# EAGLE design ESOL01 - Sol + Pump (EAGLE 7.4.0)
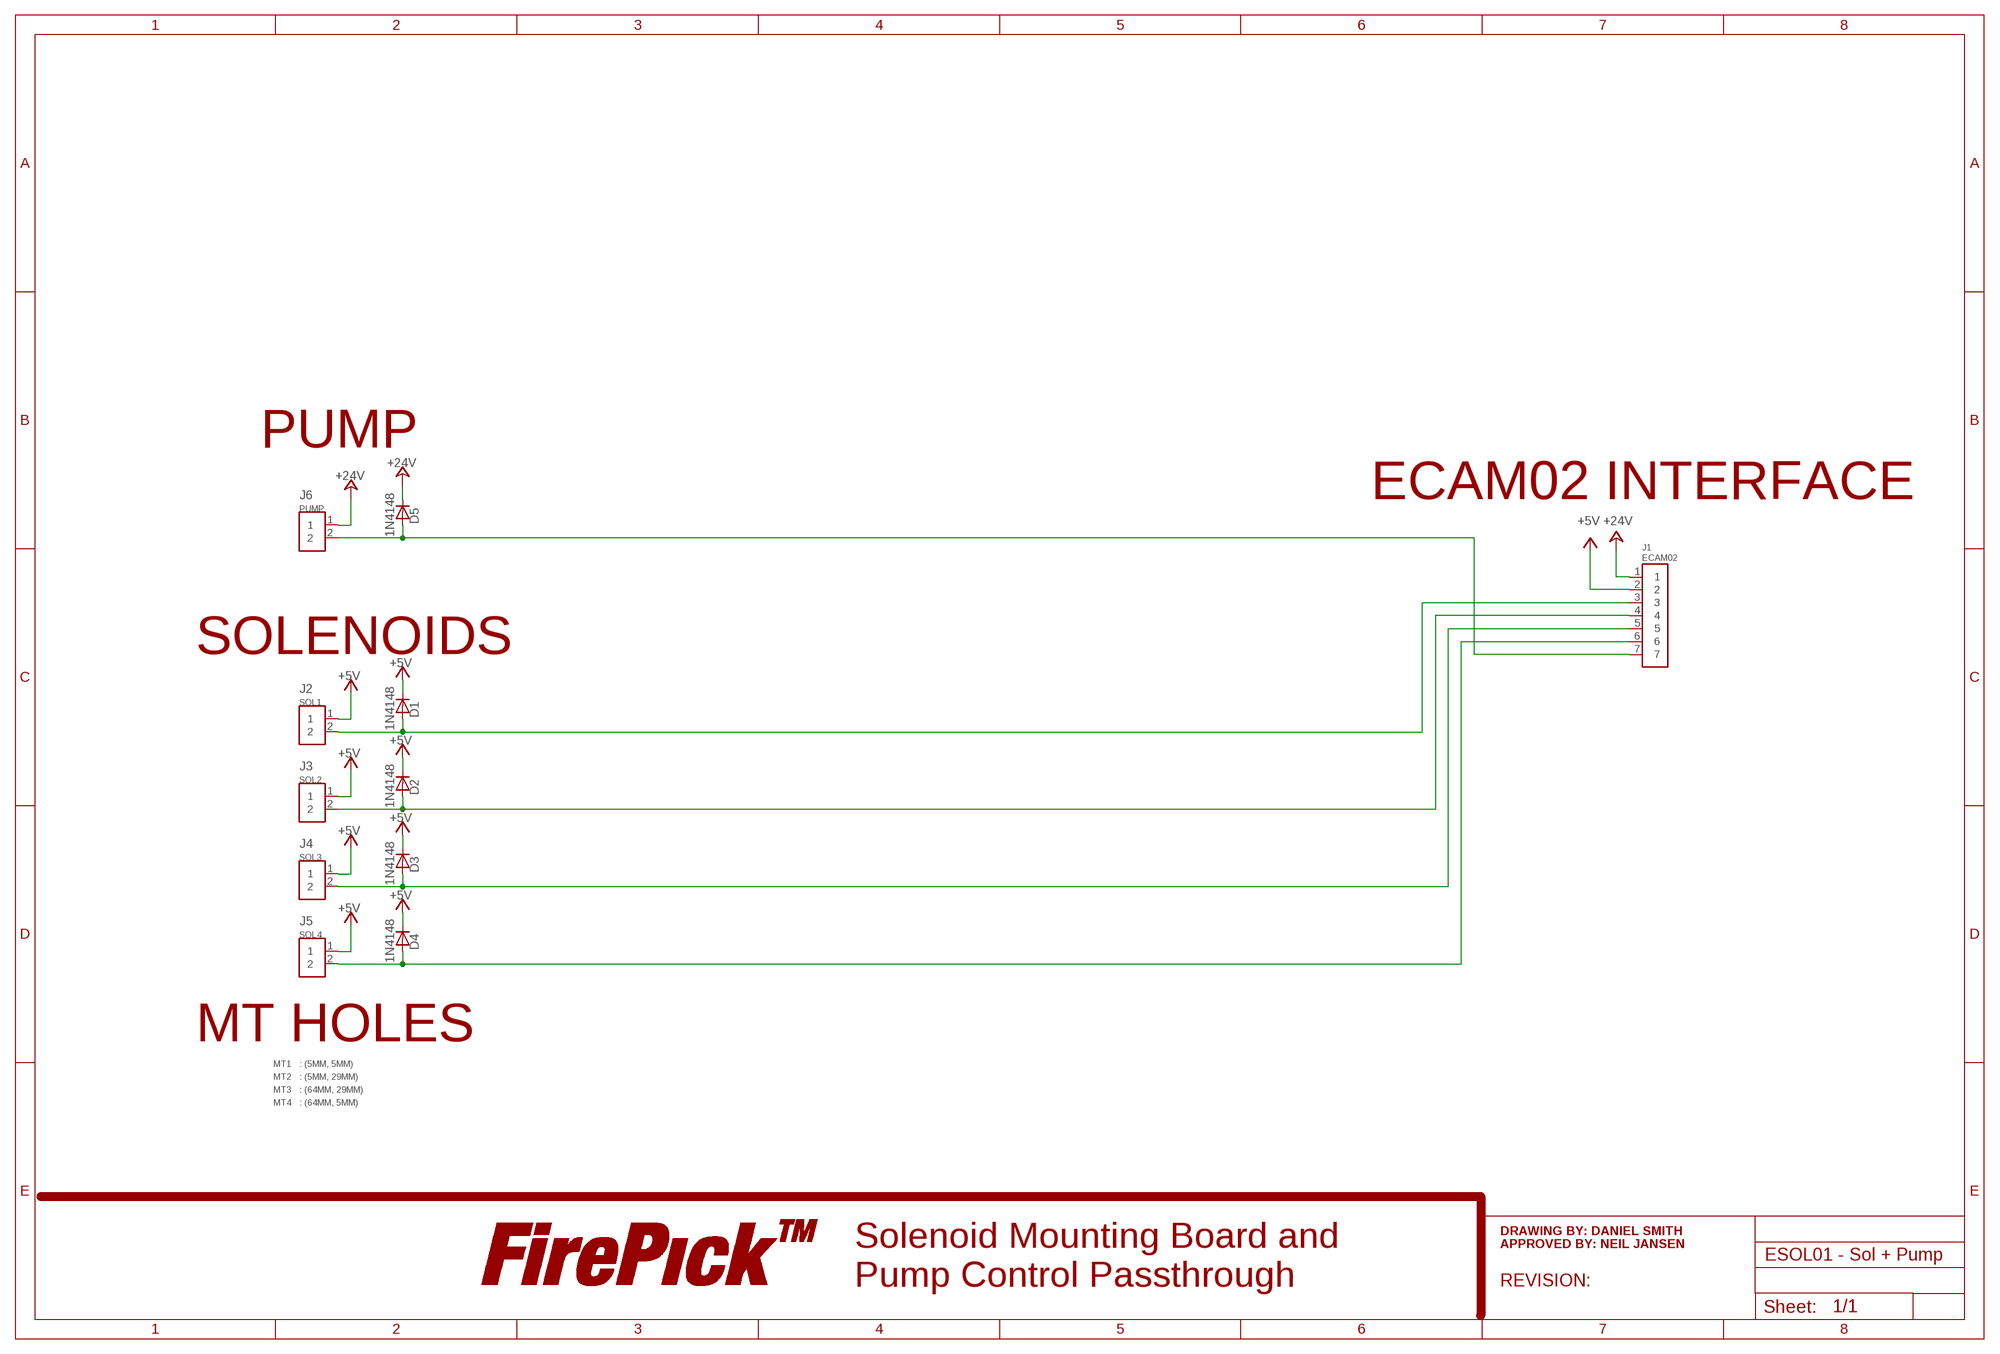
[diagram p0: schematic, sheet 1]

## Parts
D1  1N4148  CPL-DIO-1N4148SOD-323  [SOD-323]
D2  1N4148  CPL-DIO-1N4148SOD-323  [SOD-323]
D3  1N4148  CPL-DIO-1N4148SOD-323  [SOD-323]
D4  1N4148  CPL-DIO-1N4148SOD-323  [SOD-323]
D5  1N4148  CPL-DIO-1N4148SOD-323  [SOD-323]
J1  ECAM02  CPL-CON-JST-2.0MM-7P-M-SMT-VRT  [CON-JST-PH-2.0MM-7P-SMT-VRT]
J2  SOL1  HOLEX2  [HOLEX2]
J3  SOL2  HOLEX2  [HOLEX2]
J4  SOL3  HOLEX2  [HOLEX2]
J5  SOL4  HOLEX2  [HOLEX2]
J6  PUMP  CPL-CON-JST-2.0MM-2P-M-SMT-VRT  [CON-JST-PH-2.0MM-2P-SMT-VRT]
LOGO2  LOGO-FIREPICKLARGE  [LOGO-FIREPICK]
MT1  : (5MM, 5MM)  MTHOLE(M3)  [MTHOLE(M3)]
MT2  : (5MM, 29MM)  MTHOLE(M3)  [MTHOLE(M3)]
MT3  : (64MM, 29MM)  MTHOLE(M3)  [MTHOLE(M3)]
MT4  : (64MM, 5MM)  MTHOLE(M3)  [MTHOLE(M3)]

## Nets
+5V: D1.NEG(C) D2.NEG(C) D3.NEG(C) D4.NEG(C) J1.2 J2.1 J3.1 J4.1 J5.1
+24V: D5.NEG(C) J1.1 J6.1
N$7: D1.POS(A) J1.3 J2.2
N$8: D2.POS(A) J1.4 J3.2
N$9: D3.POS(A) J1.5 J4.2
N$10: D4.POS(A) J1.6 J5.2
N$11: D5.POS(A) J1.7 J6.2

## Notes on the sheet
- PUMP
- ECAM02 INTERFACE
- SOLENOIDS
- MT HOLES
- DRAWING BY: DANIEL SMITH
- APPROVED BY: NEIL JANSEN
- Solenoid Mounting Board and
  Pump Control Passthrough
- REVISION:

## Library data of the parts
D1-D5 = TinWhiskers:CPL-DIO-1N4148: Diode: 1N4148, General Purpose, 75V-100V, 100mA-500mA, 1-3Vr; Datasheet: http://www.vishay.com/docs/85886/1n4148wsfl-g.pdf
J1 = TinWhiskers:CPL-CON-JST-2.0MM-7P-M-SMT-VRT: Connector: 2.0MM Pitch, 7-Pin, (JST: B7B-PH-SM4-TB(LF)(SN)); Package: SMT, Vertical' Datasheet: http://www.jst-mfg.com/product/detail_e.php?series=199
J2-J5 = TinWhiskers:HOLEX2: 2-Pin Drill: 0.09" Dia., 0.1" Pitch
J6 = TinWhiskers:CPL-CON-JST-2.0MM-2P-M-SMT-VRT: Connector: 2.0MM Pitch, 2-Pin; Package: SMT, Vertical; Datasheet: http://www.jst-mfg.com/product/pdf/eng/ePH.pdf
LOGO2 = FirePick:LOGO-FIREPICK; BOM: EXCLUDE; DNP: T
MT1-MT4 = TinWhiskers:MTHOLE(M3): Mounting Hole: Diameter (3.5mm), Keepout (7mm)

## Board
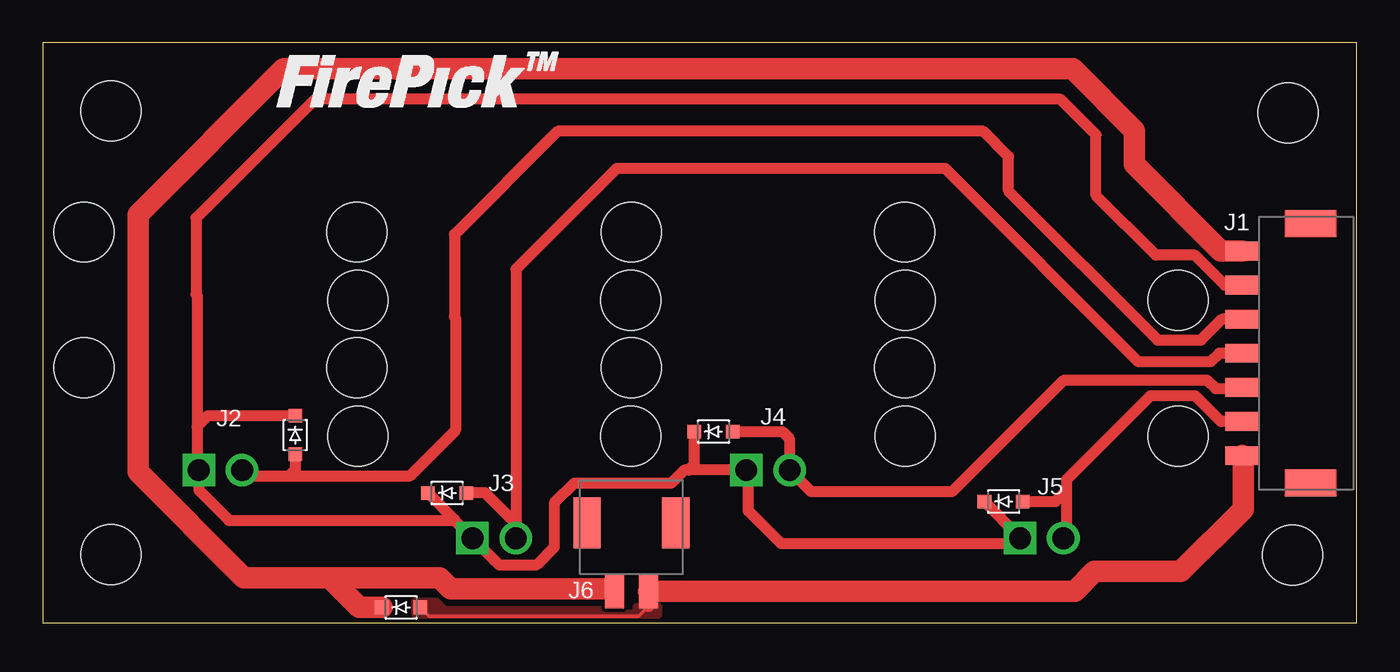
[diagram p1: board, top side]

Size 77 x 34 mm. Coordinates in mm from the lower left corner, seen from the top.
Outline: 0,0 77,0 77,34 0,34 0,0
Copper layers (1*2*15*16): Top 0.035mm / dielectric 0.2mm / Route2 0.0175mm / dielectric 0.3mm / Route15 0.0175mm / dielectric 0.2mm / Bottom 0.035mm
Design rules "HQPCB_4layer_DRU_no_angle": minimum track width 6mil, minimum drill 12mil, track to track 8mil, track to pad 8mil, pad to pad 6mil, via to via 8mil, smd to smd 0mil, copper to edge 10mil, drill to drill 8mil, minimum pad ring 6mil, minimum via ring 4mil, stop-mask expansion 2mil, vias tented up to drill 100mil, thermal gap 10mil

### Footprints (pad centres in the part's own frame; a part is rotated, then mirrored left to right if it is on the bottom)
SOD-323 = smd 0.8 x 0.8: NEG -1.125,0; POS 1.125,0
CON-JST-PH-2.0MM-7P-SMT-VRT = smd 1.1 x 2: 1 -6,0.1; 2 -4,0.1; 3 -2,0.1; 4 0,0.1; 5 2,0.1; 6 4,0.1; 7 6,0.1 | smd 1.6 x 3: NC1 -7.6,4.1; NC2 7.6,4.1
HOLEX2 = drill 1.27 square: 1 -1.27,0 | drill 1.27: 2 1.27,0 | hole 3.5: -8,6; -8,13.95; 8,13.95; 8,6
CON-JST-PH-2.0MM-2P-SMT-VRT = smd 1.1 x 2: 1 -1,0; 2 1,0 | smd 1.6 x 3: NC1 -2.6,4; NC2 2.6,4
MTHOLE(M3) = hole 3.5: 0,0

### Placement (x,y rotation side)
D1  14.8,11 270 top
D2  23.7,7.6 0 top
D3  39.3,11.2 0 top
D4  56.3,7.1 0 top
D5  21,0.9 0 top
J1  70.18,15.79 270 top
J2  10.42,8.95 0 top
J3  26.46,4.95 0 top
J4  42.5,8.95 0 top
J5  58.54,4.95 0 top
J6  34.5,1.85 0 top
LOGO2  13.51,28.47 0 top
MT1  4,4 0 top
MT2  4,30 0 top
MT3  72.97,29.89 0 top
MT4  73.23,3.96 0 top

### Tracks (layer width: path | path; a pad name or v marks a point on that pad's centre or on a via)
+5V
  Top 0.203: 9.04,9.05 J2.1 | 41.35,8.82 J4.1 | 25.15,4.91 J3.1
  Top 0.635: 9.04,11.49 9.04,19.2 8.99,19.25 8.99,23.72 15.95,30.68 59.64,30.68 61.72,28.6 61.72,25.04 65.23,21.54 67.51,21.54 69.26,19.79 J1.2 | 9.04,11.49 9.04,9.05 | 41.35,8.82 41.35,6.55 43.28,4.62 56.94,4.62 J5.1 57.27,5.01 D4.NEG | J4.1 37.85,8.95 | 37.85,8.95 37.6,8.95 36.83,8.18 31.14,8.18 29.97,7.01 29.97,4.42 28.96,3.4 26.72,3.4 26.47,3.65 26.47,3.66 J3.1 24.14,5.99 | J2.1 9.14,7.77 10.92,5.99 24.14,5.99 | 24.14,5.99 24.14,6.04 D2.NEG | D1.NEG 9.67,12.12 9.04,11.49 | D3.NEG 38.17,9.28 37.85,8.95
+24V
  Top 0.203: 33.35,2 J6.1
  Top 1.27: 33.35,2 23.9,2 23.26,2.64 16.8,2.64 | J1.1 69.04,21.79 63.96,26.87 63.96,28.85 60.35,32.46 14.12,32.46 5.59,23.93 5.59,8.84 11.79,2.64 16.8,2.64 | D5.NEG 18.54,0.9 16.8,2.64
N$7
  Top 0.635: J2.2 12.05,8.59 14.41,8.59 | 14.41,8.59 21.49,8.59 24.18,11.28 24.18,17.88 24.13,17.93 24.13,22.76 30.18,28.8 55.12,28.8 56.59,27.33 56.59,25.3 65.33,16.56 67.87,16.56 69.1,17.79 J1.3 | D1.POS 14.8,8.97 14.41,8.59
N$8
  Top 0.635: J1.4 68.93,15.79 68.43,15.29 64.21,15.29 52.88,26.62 33.63,26.62 27.74,20.73 27.74,5.79 | J3.2 27.74,5.79 | 27.74,5.79 25.91,7.62 24.84,7.62 D2.POS
N$9
  Top 0.635: J1.5 70.21,13.72 68.73,13.72 68.22,14.22 59.84,14.22 53.29,7.67 45.04,7.67 J4.2 43.75,8.96 43.75,10.79 43.35,11.2 D3.POS
N$10
  Top 0.635: J1.6 69.03,11.79 67.51,13.31 64.92,13.31 59.99,8.38 59.99,7.75 | 59.99,7.75 59.99,5.14 J5.2 | D4.POS 59.35,7.1 59.99,7.75
N$11
  Top 0.203: 35.5,0.96 34.92,0.38 22.64,0.38 D5.POS
  Top 0.635: J6.2 35.5,0.96
  Top 1.27: J6.2 60.47,1.85 61.62,3 66.7,3 70.36,6.66 70.36,9.72 J1.7
  pour Top (no thermals): 34.61,0.83 34.61,1.02 34.73,1.14 36.13,1.14 36.26,1.02 36.26,0.38 35.94,0.06 22.03,0.06 21.65,0.44 21.65,1.33 21.78,1.46 23.11,1.46 23.62,0.95 32.7,0.95 32.89,0.76 34.54,0.76